# EasyEDA schematic D2_2020-10-05_16-15-53.json
TITLE: SmartWatch D2; REV: 1.0; Date: 2017-10-20; Sheet: 1/1; Drawn By: Jake Drew
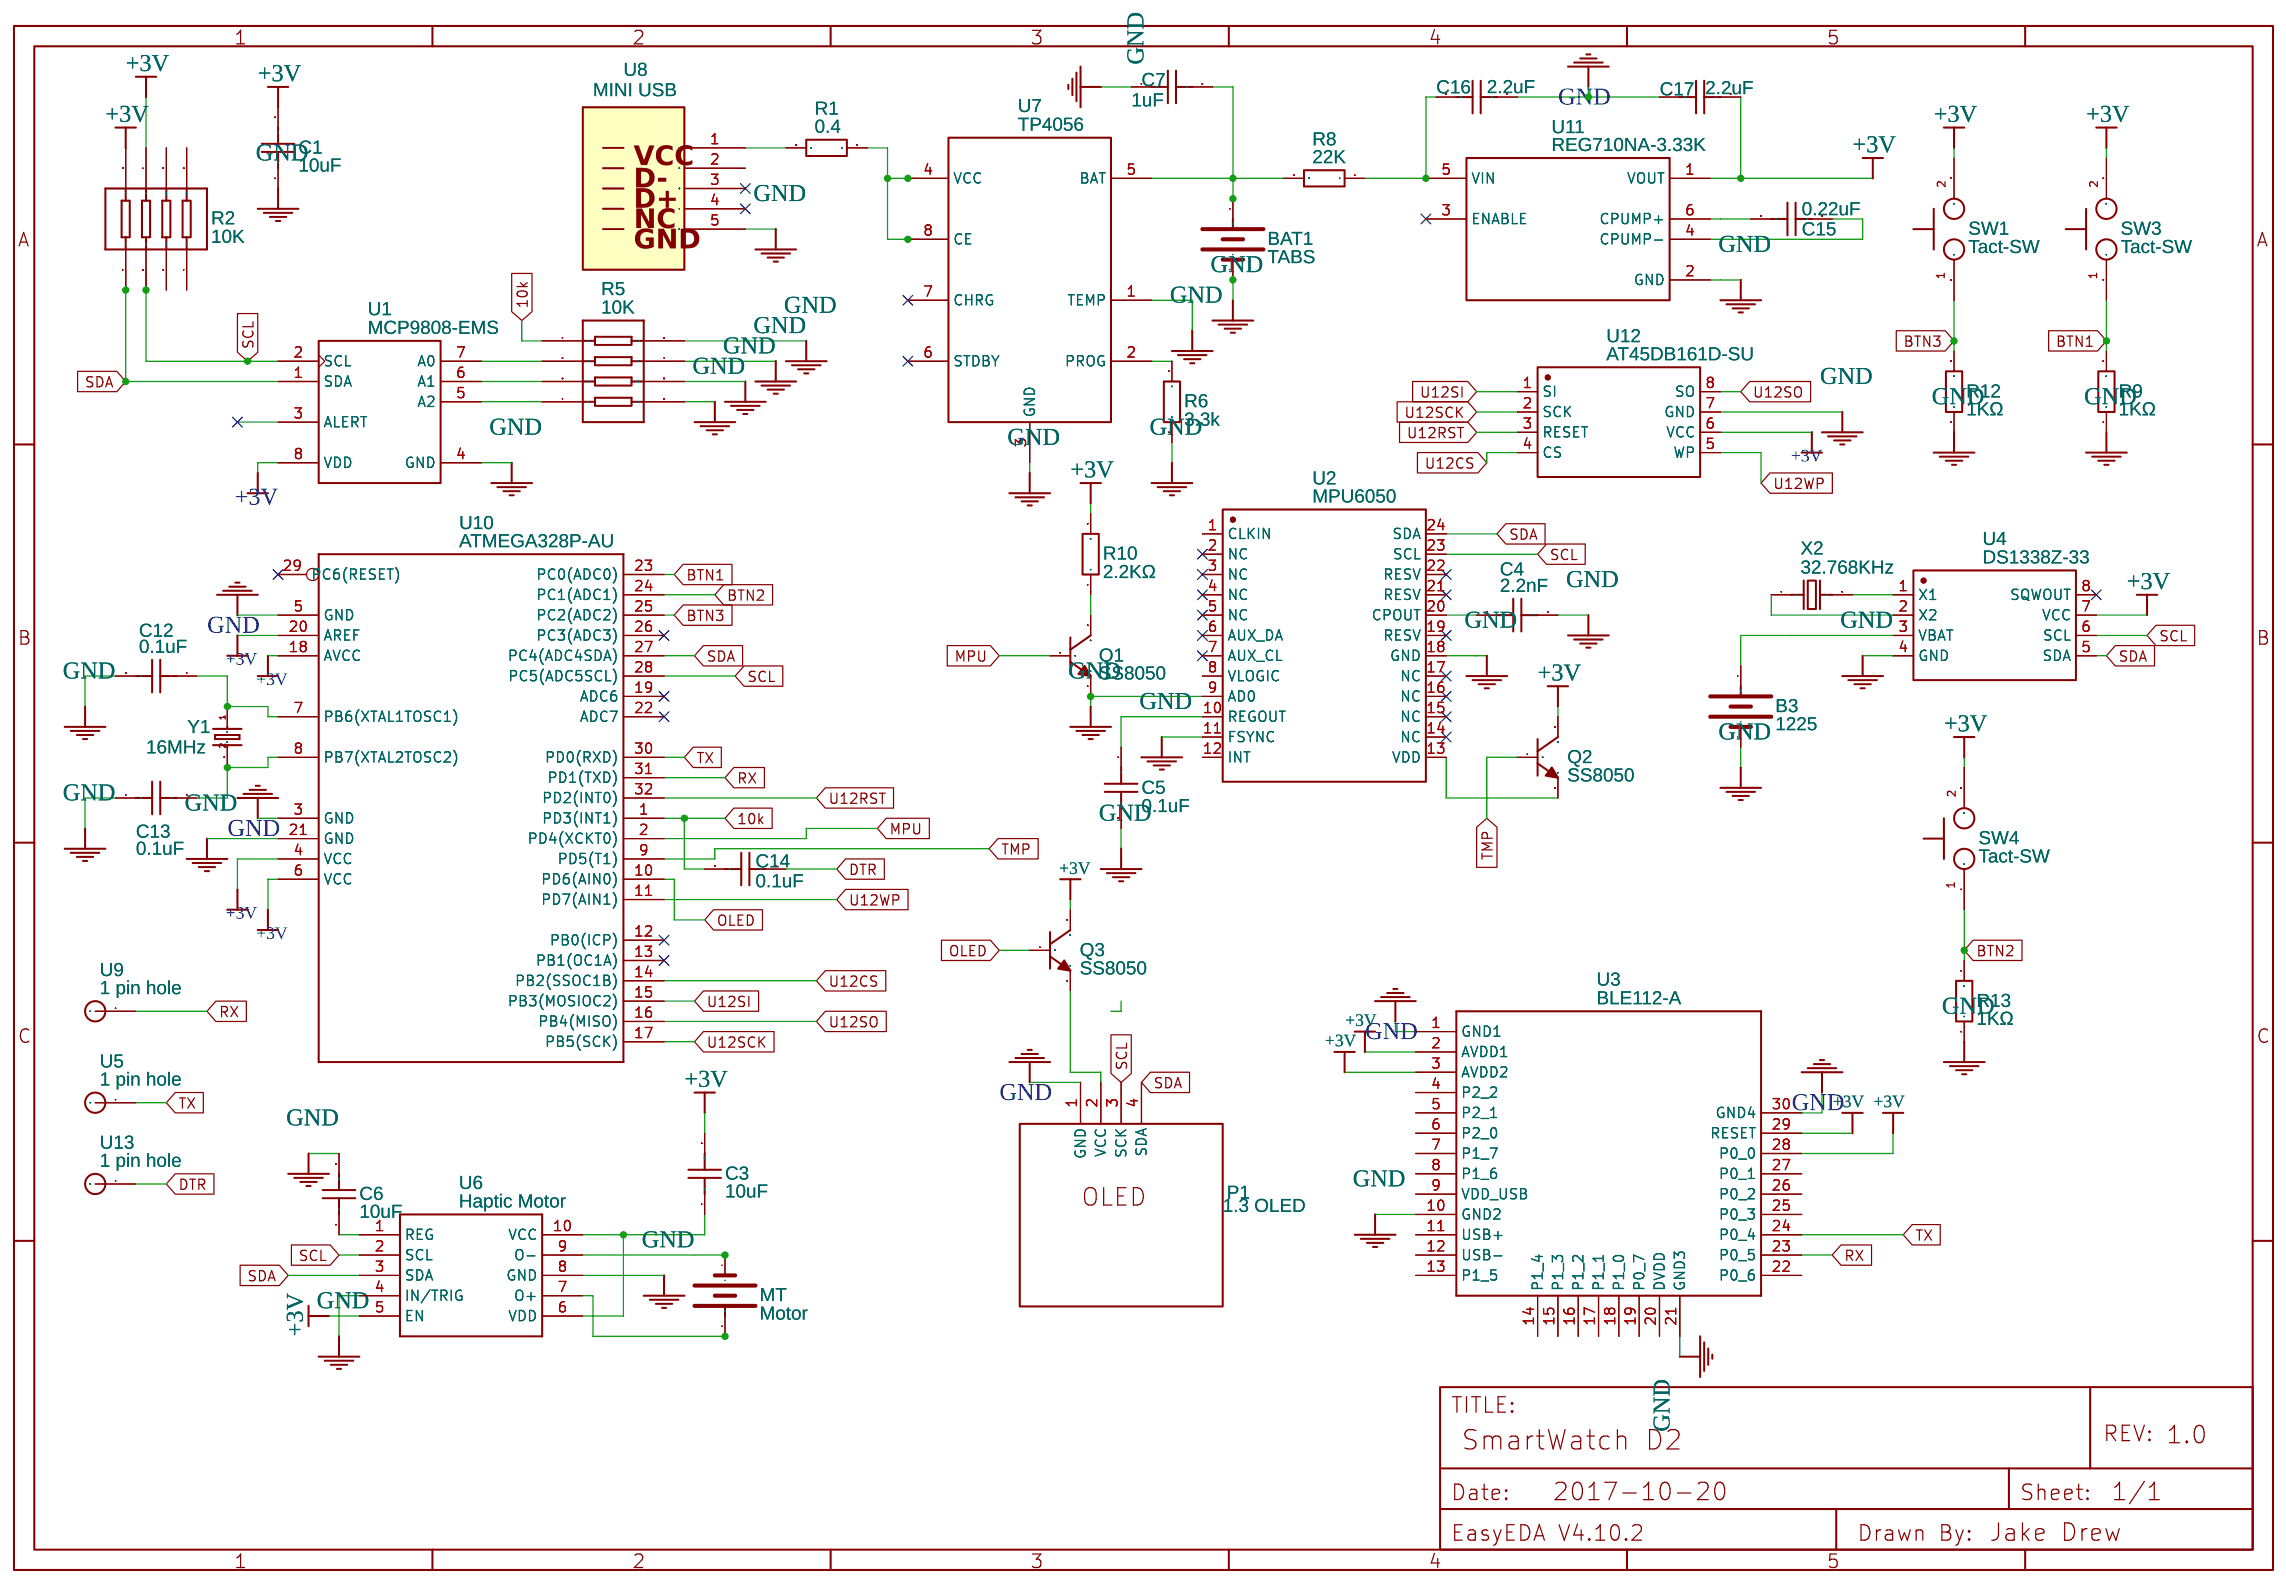
[diagram p0: schematic sheet]

## Parts
B3  1225  [LIPO-110-TABS]
BAT1  TABS  [LIPO-110-TABS]
C1  10uF  [0805]
C3  10uF  [0805]
C4  2.2nF  [0805]
C5  0.1uF  [0805]
C6  10uF  [0805]
C7  1uF  [0805]
C12  0.1uF  [0805]
C13  0.1uF  [0805]
C14  0.1uF  [0805]
C15  0.22uF  [0805]
C16  2.2uF  [0805]
C17  2.2uF  [0805]
MT  Motor  [LIPO-110-TABS]
P1  1.3 OLED  [OLED 1.3 IIC/I2C]
Q1  SS8050  [SOT-23(SOT-23-3)]
Q2  SS8050  [SOT-23(SOT-23-3)]
Q3  SS8050  [SOT-23(SOT-23-3)]
R1  0.4  [0805]
R2  10K  [0603_X4]
R5  10K  [0603_X4]
R6  3.3k  [1210]
R8  22K  [1206]
R9  1KΩ  [1206]
R10  2.2KΩ  [0805]
R12  1KΩ  [1206]
R13  1KΩ  [1206]
SW1  Tact-SW  [TL3330AF260QG_3D]
SW3  Tact-SW  [TL3330AF260QG_3D]
SW4  Tact-SW  [TL3330AF260QG_3D]
U1  MCP9808-EMS  [MSOP8]
U2  MPU6050  [QFN-24_4X4X05P]
U3  BLE112-A  [BLE112-A]
U4  DS1338Z-33  [SOP-8_150MIL]
U5  1 pin hole  [1-PIN]
U6  Haptic Motor  [TSSOP10]
U7  TP4056  [SOP-8_EP_150MIL]
U8  MINI USB  [USB-MINI-B]
U9  1 pin hole  [1-PIN]
U10  ATMEGA328P-AU  [TQFP32-0.8-7X7MM]
U11  REG710NA-3.33K  [SOT-23-6]
U12  AT45DB161D-SU  [SOIC-8]
U13  1 pin hole  [1-PIN]
X2  32.768KHz  [3*8]
Y1  16MHz  [X2-SMD-5.0X3.2X1.3MM]

## Library data of the parts
B3 BAT1 MT = -: Battery Holders; catid: 20; Contributor: SparkFun; Manufacturer Part: ?
C1 C3-C7 C12-C17 = -: Voltage: 25V; Tolerance: ±10%; Supplier: LCSC; Manufacturer: FH(风华); Manufacturer Part: 0805B105K250NT; Supplier Part: C89190
P1 = -: catid: 20; sourceId: 1T5FDZYC8; Supplier: Aliexpress; Manufacturer Part: ?
Q1-Q3 = -: Supplier: LCSC; Manufacturer: CJ; LCSC Assembly: Yes; Supplier Part: C2150
R1 = -: Power: 1/8W; Tolerance: ±1%; Supplier: LCSC; Manufacturer: UniOhm; Manufacturer Part: 0805W8F147KT5E; Supplier Part: C68930
R2 R5 = -: Tolerance: ±5%; Supplier: LCSC; Manufacturer: UniOhm; Manufacturer Part: 4D03WGJ0102T5E; LCSC Assembly: Yes; Supplier Part: C20197
R6 = -: Power: 1/3W; Tolerance: ±1%; Supplier: LCSC; Manufacturer: UniOhm; Manufacturer Part: 1210W3F680KT5E; Supplier Part: C38887
R8 R9 R12 R13 = -: Power: 1/4W; Tolerance: ±1%; Supplier: LCSC; Manufacturer: UniOhm; Manufacturer Part: 1206W4F1001T5E; LCSC Assembly: Yes; Supplier Part: C4410
R10 = -: Power: 1/8W; Tolerance: ±1%; Supplier: LCSC; Manufacturer: UniOhm; Manufacturer Part: 0805W8F2201T5E; LCSC Assembly: Yes; Supplier Part: C17520
SW1 SW3 SW4 = -: Manufacturer Part: TL3330AF260QG; link: https://www.semikart.com/product/TL3330AF260QG/168338; Contributor: ChethuGowda; Supplier: Mouser
U1 = -: +  - 0.5 degC Maximum Accuracy Digital Temperature Sensor, 400 uA, 2.7 to 5.5 V, -40 to 125 degC, 8-pin MSOP (MS8), Tube; catid: 20; Manufacturer Part: ?
U2 = -: catid: 20; sourceId: 1T5FDZYC8; Supplier: LCSC; Manufacturer: InvenSense; LCSC Assembly: Yes; Supplier Part: C24112
U3 = -: catid: 20; Contributor: SparkFun; Manufacturer Part: ?
U4 = -: Supplier: LCSC; Manufacturer: MAXIM; Supplier Part: C49105
U5 U9 U13 = -: Contributor: CameronRP
U6 U8 = -: catid: 20; Manufacturer Part: ?
U7 = -: Contributor: Guest; Supplier: LCSC; Manufacturer: TOPPOWER; LCSC Assembly: Yes; Supplier Part: C16581
U10 = -: IC MCU 8Bit 32KB ISP flash 20MHz  1.8v-5.5v; catid: 20
U11 = -: 3.3 V, Buck  Boost Charge Pump, 30 mA, 1.8 to 5.5 V Input, -40 to 85 degC, 6-pin SOT23 (DBV6), Green (RoHS  no SbBr); catid: 20; Manufacturer Part: ?
U12 = -: Manufacturer Part: ?
X2 = -: Supplier: LCSC; Manufacturer: KDS; Manufacturer Part: DT-38 32.768KHz; Supplier Part: C93228
Y1 = -: SMD 16MHz-8pF-20ppm-40R; catid: 20; Manufacturer Part: X053201602002

## Nets
+3V: C1.2 C3.2 C17.2 Q2.3(C) Q3.3(C) R2.7 R2.8 R10.2 SW1.2 SW3.2 SW4.2 U1.8(VDD) U3.2(AVDD1) U3.3(AVDD2) U3.28(P0_0) U3.29(RESET) U4.7(VCC) U6.5(EN) U10.4(VCC) U10.6(VCC) U10.18(AVCC) U10.20(AREF) U11.1(VOUT) U12.6(VCC)
GND: B3.- BAT1.- C1.1 C4.1 C5.2 C6.2 C7.1 C12.2 C13.1 C16.1 C17.1 P1.1(GND) Q1.2(E) R5.5 R5.6 R5.7 R5.8 R6.1 R9.1 R12.1 R13.1 U1.4(GND) U2.9(AD0) U2.11(FSYNC) U2.18(GND) U3.1(GND1) U3.10(GND2) U3.21(GND3) U3.30(GND4) U4.4(GND) U6.4(IN/TRIG) U6.8(GND) U7.1(TEMP) U7.3(GND) U8.5 U10.3(GND) U10.5(GND) U10.21(GND) U11.2(GND) U12.7(GND)
10k: C14.2 R5.1 U10.1(PD3(INT1))
BTN1: R9.2 SW3.1 U10.23(PC0(ADC0))
BTN2: R13.2 SW4.1 U10.24(PC1(ADC1))
BTN3: R12.2 SW1.1 U10.25(PC2(ADC2))
DTR: C14.1 U13.1
MPU: Q1.1(B) U10.2(PD4(XCKT0))
OLED: Q3.1(B) U10.10(PD6(AIN0))
RX: U3.23(P0_5) U9.1 U10.31(PD1(TXD))
SCL: P1.3(SCK) R2.2 U1.2(SCL) U2.23(SCL) U4.6(SCL) U6.2(SCL) U10.28(PC5(ADC5SCL))
SDA: P1.4(SDA) R2.1 U1.1(SDA) U2.24(SDA) U4.5(SDA) U6.3(SDA) U10.27(PC4(ADC4SDA))
TMP: Q2.1(B) U10.9(PD5(T1))
TX: U3.24(P0_4) U5.1 U10.30(PD0(RXD))
U12CS: U10.14(PB2(SSOC1B)) U12.4(CS)
U12RST: U10.32(PD2(INT0)) U12.3(RESET)
U12SCK: U10.17(PB5(SCK)) U12.2(SCK)
U12SI: U10.15(PB3(MOSIOC2)) U12.1(SI)
U12SO: U10.16(PB4(MISO)) U12.8(SO)
U12WP: U10.11(PD7(AIN1)) U12.5(WP)
Net-(B3-+): B3.+ U4.3(VBAT)
Net-(BAT1-+): BAT1.+ C7.2 R8.2 U7.5(BAT)
Net-(C3-1): C3.1 U6.6(VDD) U6.10(VCC)
Net-(C4-2): C4.2 U2.20(CPOUT)
Net-(C5-1): C5.1 U2.10(REGOUT)
Net-(C6-1): C6.1 U6.1(REG)
Net-(C12-1): C12.1 U10.7(PB6(XTAL1TOSC1)) Y1.1
Net-(C13-2): C13.2 U10.8(PB7(XTAL2TOSC2)) Y1.2
Net-(C15-1): C15.1 U11.6(CPUMP+)
Net-(C15-2): C15.2 U11.4(CPUMP-)
Net-(C16-2): C16.2 R8.1 U11.5(VIN)
Net-(MT-+): MT.+ U6.7(O+)
Net-(MT--): MT.- U6.9(O-)
Net-(P1-2): P1.2(VCC) Q3.2(E)
Net-(Q1-3): Q1.3(C) R10.1
Net-(Q2-2): Q2.2(E) U2.13(VDD)
Net-(R1-1): R1.1 U7.4(VCC) U7.8(CE)
Net-(R1-2): R1.2 U8.1
Net-(R5-2): R5.2 U1.7(A0)
Net-(R5-3): R5.3 U1.6(A1)
Net-(R5-4): R5.4 U1.5(A2)
Net-(R6-2): R6.2 U7.2(PROG)
Net-(U4-1): U4.1(X1) X2.2
Net-(U4-2): U4.2(X2) X2.1

Not connected (* = marked no-connect by the designer): R2 3 4 5 6; U1 3(ALERT); U2 1(CLKIN) 2(NC)* 3(NC)* 4(NC)* 5(NC)* 6(AUX_DA)* 7(AUX_CL)* 8(VLOGIC) 12(INT) 14(NC)* 15(NC)* 16(NC)* 17(NC)* 19(RESV)* 21(RESV)* 22(RESV)*; U3 4(P2_2) 5(P2_1) 6(P2_0) 7(P1) 8(P1_6) 9(VDD_USB) 11(USB+) 12(USB-) 13(P1_5) 14(P1_4) 15(P1_3) 16(P1_2) 17(P1_1) 18(P1_0) 19(P0_7) 20(DVDD) 22(P0_6) 25(P0_3) 26(P0_2) 27(P0_1); U4 8(SQWOUT)*; U7 6(STDBY)* 7(CHRG)*; U8 2 3* 4*; U10 12(PB0(ICP))* 13(PB1(OC1A))* 19(ADC6)* 22(ADC7)* 26(PC3(ADC3))* 29(PC6(RESET))*; U11 3(ENABLE)*
